# EAGLE design SM5100B_dev_board-v14 (EAGLE 5.04)

## Sheet 1 of 2
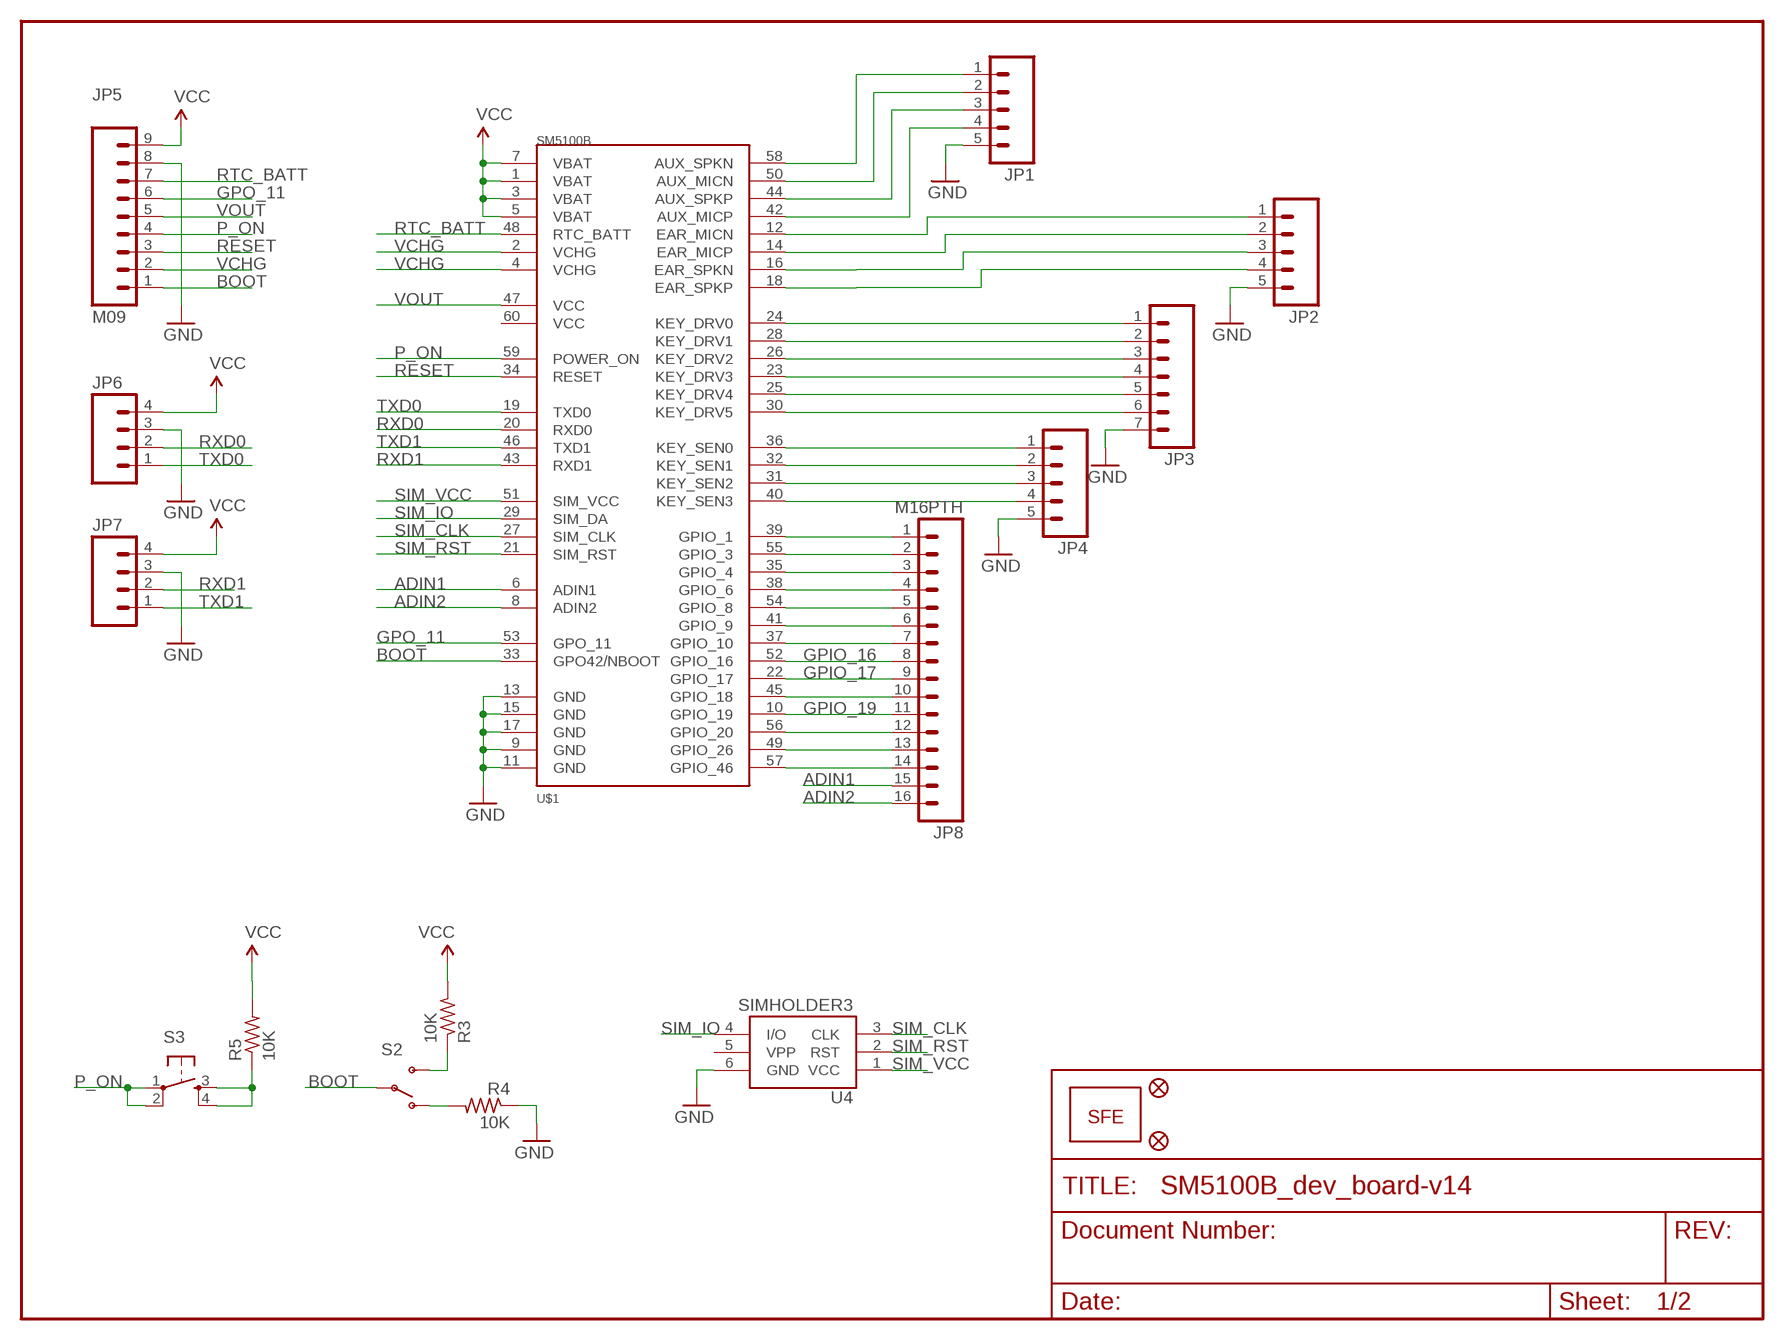
[diagram p0: schematic, sheet 1]

### Parts
JP1  M05PTH  [1X05]
JP2  M05PTH  [1X05]
JP3  M07  [1X07]
JP4  M05PTH  [1X05]
JP5  M09  [1X09]
JP6  M04PTH  [1X04]
JP7  M04PTH  [1X04]
JP8  M16PTH  [1X16]
JP9  LOGO-SFENEW  [SFE-NEW-WEBLOGO]
JP10  FIDUCIAL1X2  [FIDUCIAL-1X2]
JP11  FIDUCIAL1X2  [FIDUCIAL-1X2]
R3  10K  R-US_R0603  [R0603]
R4  10K  R-US_R0603  [R0603]
R5  10K  R-US_R0603  [R0603]
S2  SWITCH-SPSTSMD  [AYZ0202]
S3  TAC_SWITCHSMD  [TACTILE_SWITCH_SMD]
U4  SIMHOLDER3  [SIMHOLDER3]
U$1  SM5100B  [SM5100B]

### Nets
ADIN1: JP8.15 U$1.6(ADIN1)
ADIN2: JP8.16 U$1.8(ADIN2)
BOOT: JP5.1 S2.2(P) U$1.33(GPO42/NBOOT)
GND: JP1.5 JP2.5 JP3.7 JP4.5 JP5.8 JP6.3 JP7.3 R4.1 U4.6(GND) U$1.9(GND) U$1.11(GND) U$1.13(GND) U$1.15(GND) U$1.17(GND) ; also sheet 2
GPIO_16: JP8.8 U$1.52(GPIO_16) ; also sheet 2
GPIO_17: JP8.9 U$1.22(GPIO_17) ; also sheet 2
GPIO_19: JP8.11 U$1.10(GPIO_19) ; also sheet 2
GPO_11: JP5.6 U$1.53(GPO_11)
N$15: R3.1 S2.3(S)
N$16: R4.2 S2.1(O)
N$20: R5.1 S3.3 S3.4
N$31: JP1.1 U$1.58(AUX_SPKN)
N$32: JP1.2 U$1.50(AUX_MICN)
N$33: JP1.3 U$1.44(AUX_SPKP)
N$34: JP1.4 U$1.42(AUX_MICP)
N$35: JP2.1 U$1.12(EAR_MICN)
N$36: JP2.2 U$1.14(EAR_MICP)
N$37: JP2.3 U$1.16(EAR_SPKN)
N$38: JP2.4 U$1.18(EAR_SPKP)
N$39: JP3.1 U$1.24(KEY_DRV0)
N$40: JP3.2 U$1.28(KEY_DRV1)
N$41: JP3.3 U$1.26(KEY_DRV2)
N$42: JP3.4 U$1.23(KEY_DRV3)
N$43: JP3.5 U$1.25(KEY_DRV4)
N$44: JP3.6 U$1.30(KEY_DRV5)
N$45: JP4.1 U$1.36(KEY_SEN0)
N$46: JP4.2 U$1.32(KEY_SEN1)
N$47: JP4.3 U$1.31(KEY_SEN2)
N$48: JP4.4 U$1.40(KEY_SEN3)
N$49: JP8.1 U$1.39(GPIO_1)
N$50: JP8.2 U$1.55(GPIO_3)
N$51: JP8.3 U$1.35(GPIO_4)
N$52: JP8.4 U$1.38(GPIO_6)
N$53: JP8.5 U$1.54(GPIO_8)
N$54: JP8.6 U$1.41(GPIO_9)
N$55: JP8.7 U$1.37(GPIO_10)
N$58: JP8.10 U$1.45(GPIO_18)
N$60: JP8.12 U$1.56(GPIO_20)
N$61: JP8.13 U$1.49(GPIO_26)
N$62: JP8.14 U$1.57(GPIO_46)
P_ON: JP5.4 S3.1 S3.2 U$1.59(POWER_ON)
RESET: JP5.3 U$1.34(RESET)
RTC_BATT: JP5.7 U$1.48(RTC_BATT)
RXD0: JP6.2 U$1.20(RXD0) ; also sheet 2
RXD1: JP7.2 U$1.43(RXD1)
SIM_CLK: U4.3(CLK) U$1.27(SIM_CLK)
SIM_IO: U4.4(I/O) U$1.29(SIM_DA)
SIM_RST: U4.2(RST) U$1.21(SIM_RST)
SIM_VCC: U4.1(VCC) U$1.51(SIM_VCC)
TXD0: JP6.1 U$1.19(TXD0) ; also sheet 2
TXD1: JP7.1 U$1.46(TXD1)
VCC: JP5.9 JP6.4 JP7.4 R3.2 R5.2 U$1.1(VBAT) U$1.3(VBAT) U$1.5(VBAT) U$1.7(VBAT) ; also sheet 2
VCHG: JP5.2 U$1.2(VCHG) U$1.4(VCHG)
VOUT: JP5.5 U$1.47(VCC)
Unconnected: U4.5(VPP) U$1.60(VCC)

## Sheet 2 of 2
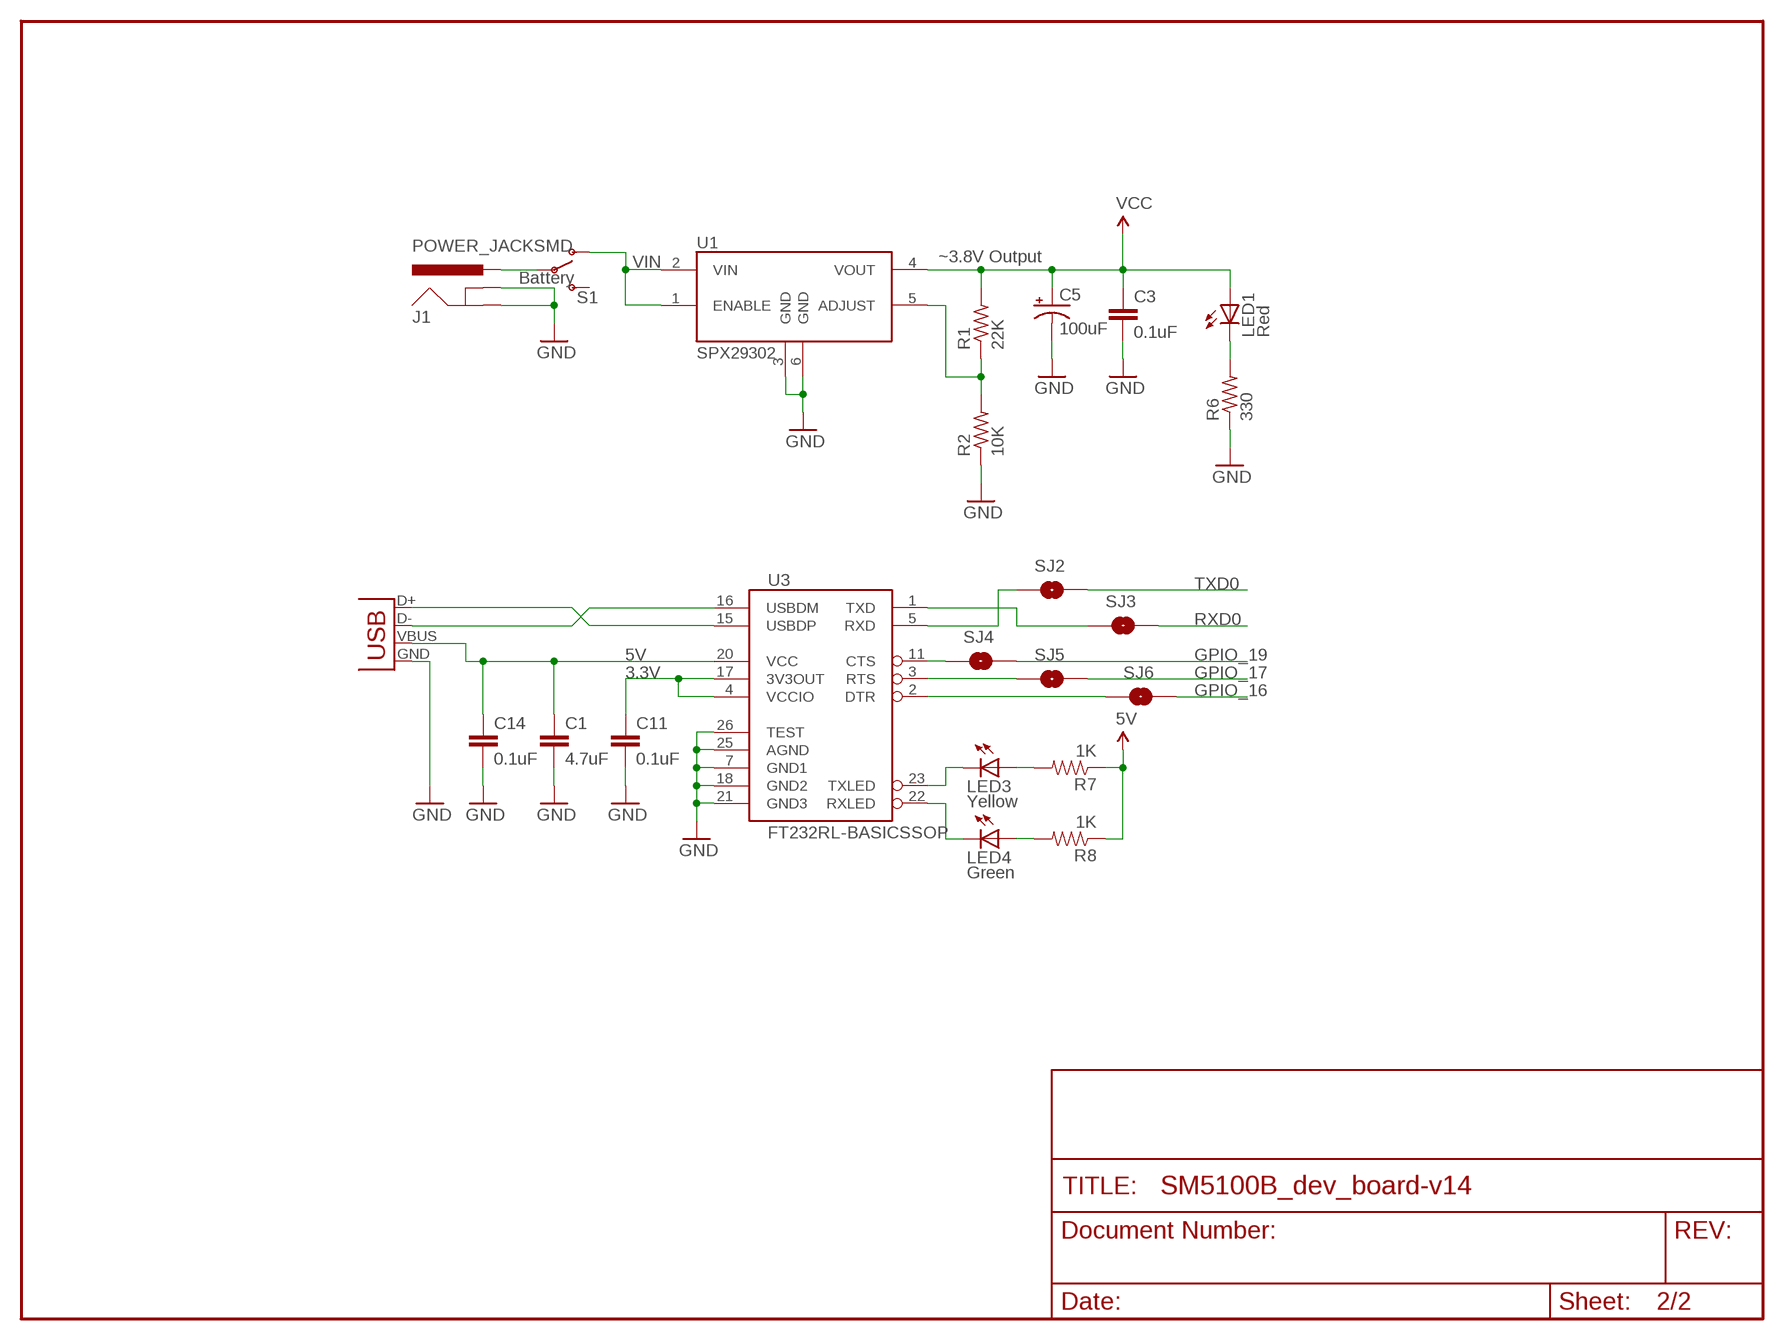
[diagram p1: schematic, sheet 2]

### Parts
C1  4.7uF  CAP0402-CAP  [0402-CAP]
C3  0.1uF  CAP0603-CAP  [0603-CAP]
C5  100uF  CAP_POL7343  [EIA7343]
C11  0.1uF  CAP0402-CAP  [0402-CAP]
C14  0.1uF  CAP0402-CAP  [0402-CAP]
J1  POWER_JACKSMD  [POWER_JACK_SMD]
LED1  Red  LED0603  [LED-0603]
LED3  Yellow  LED0603  [LED-0603]
LED4  Green  LED0603  [LED-0603]
R1  22K  R-US_R0603  [R0603]
R2  10K  R-US_R0603  [R0603]
R6  330  R-US_R0603  [R0603]
R7  1K  RESISTOR0402-RES  [0402-RES]
R8  1K  RESISTOR0402-RES  [0402-RES]
S1  Battery  SWITCH-SPSTSMD  [AYZ0202]
SJ2  SOLDERJUMPERNC2  [SJ_2S-NOTRACE]
SJ3  SOLDERJUMPERNC2  [SJ_2S-NOTRACE]
SJ4  SOLDERJUMPERNC2  [SJ_2S-NOTRACE]
SJ5  SOLDERJUMPERNC2  [SJ_2S-NOTRACE]
SJ6  SOLDERJUMPERNC2  [SJ_2S-NOTRACE]
U1  SPX29302  [Q5-DD_SPX29300]
U3  FT232RL-BASICSSOP  [SSOP28DB]
X1  USBSMD  [USB-MINIB]

### Nets
3.3V [vcc]: C11.1 U3.4(VCCIO) U3.17(3V3OUT)
5V [vcc]: C1.1 C14.1 R7.1 R8.1 U3.20(VCC) X1.VBUS
ADJUST: R1.1 R2.2 U1.5(ADJUST)
GND: C1.2 C3.2 C5.C(-) C11.2 C14.2 J1.GND(GNDBREAK) J1.P$4(GND) R2.1 R6.1 U1.3(GND) U1.6(GND) U3.7(GND1) U3.18(GND2) U3.21(GND3) U3.25(AGND) U3.26(TEST) X1.GND ; also sheet 1
GPIO_16: SJ6.2 ; also sheet 1
GPIO_17: SJ5.2 ; also sheet 1
GPIO_19: SJ4.2 ; also sheet 1
N$1: U3.15(USBDP) X1.D+
N$2: SJ2.1 U3.5(RXD)
N$3: U3.16(USBDM) X1.D-
N$4: SJ3.1 U3.1(TXD)
N$6: SJ4.1 U3.11(CTS)
N$7: LED3.A R7.2
N$12: SJ5.1 U3.3(RTS)
N$13: SJ6.1 U3.2(DTR)
N$14: J1.VIN0(PWR) S1.2(P)
N$17: LED1.C R6.2
N$18: LED4.A R8.2
RXD0: SJ3.2 ; also sheet 1
RXLED: LED4.C U3.22(RXLED)
TXD0: SJ2.2 ; also sheet 1
TXLED: LED3.C U3.23(TXLED)
VCC: C3.1 C5.A(+) LED1.A R1.2 U1.4(VOUT) ; also sheet 1
VIN: S1.1(O) U1.1(ENABLE) U1.2(VIN)
Unconnected: S1.3(S)

### Notes on the sheet
- ~3.8V Output

## Library data of the parts
C1 C3 C11 C14 = SparkFun:CAP: Capacitor Standard 0603 ceramic capacitor, and 0.1" leaded capacitor.
C5 = SparkFun:CAP_POL: Capacitor Polarized These are standard SMD and PTH capacitors. Normally 10uF, 47uF, and 100uF in electrolytic and tantalum varieties. Always verify the external diameter of the through hole cap, it varies with capacity, voltage, and manufacturer. The EIA devices should be standard.
J1 = SparkFun:POWER_JACK: Power Jack This is the standard 5.5mm barrel jack for power. The PTH is the most common, proven, reliable, footprint. All others are experimental. The Slot footprint only works if the mill layer is transmitted to the PCB fab house so be warned. Spark Fun Electronics SKU : PRT-00119. Mating wall wart : TOL-00298 (and others)
JP1 JP2 JP4 = SparkFun:M05: Header 5 Standard 5-pin 0.1" header. Use with straight break away headers (SKU : PRT-00116), right angle break away headers (PRT-00553), swiss pins (PRT-00743), machine pins (PRT-00117), and female headers (PRT-00115). Molex polarized connector foot print use with SKU : PRT-08230 with associated crimp pins and housings.
JP3 = SparkFun:M07: Header 7 Standard 7-pin 0.1" header. Use with straight break away headers (SKU : PRT-00116), right angle break away headers (PRT-00553), swiss pins (PRT-00743), machine pins (PRT-00117), and female headers (PRT-00115). NOTES ON THE VARIANTS LOCK and LOCK_LONGPADS... This footprint was designed to help hold the alignment of a through-hole component (i.e. 7-pin header) while soldering it into place. You may notice that each hole has been shifted either up or down by 0.005 of an inch from it's more standard position (which is usually a perfectly straight line). This slight alteration caused the pins (the squares in the middle) to touch the edges of the holes. Because they are alternating, it causes a "brace" to hold the header in place. 0.005 has proven to be the perfect amount of "off-center" position when using our standard breakaway headers. Although looks a little odd when you look at the bare footprint, once you have a header in there, the alteration is very hard to notice. Also, if you push a header all the way into place, it is covered up entirely on the bottom side. This idea of altering the position of holes to aid alignment will be further integrated into the Sparkfun Library for other footprints. It can help hold any component with 3 or more connection pins.
JP5 = SparkFun:M09: Header 9 Standard 9-pin 0.1" header. Use with straight break away headers (SKU : PRT-00116), right angle break away headers (PRT-00553), swiss pins (PRT-00743), machine pins (PRT-00117), and female headers (PRT-00115).
JP6 JP7 = SparkFun:M04: Header 4 Standard 4-pin 0.1" header. Use with straight break away headers (SKU : PRT-00116), right angle break away headers (PRT-00553), swiss pins (PRT-00743), machine pins (PRT-00117), and female headers (PRT-00115). Molex polarized connector foot print use with SKU : PRT-08231 with associated crimp pins and housings.
JP8 = SparkFun:M16
JP9 = SparkFun:LOGO-SFE: Spark Fun Electronics PCB Logo This is the standard Spark Fun Electronics PCB logo.
JP10 JP11 = SparkFun:FIDUCIAL: Fiducial Alignment Points Various fiducial points for machine vision alignment.
LED1 LED3 LED4 = SparkFun:LED: LEDs Standard schematic elements and footprints for 5mm, 3mm, 1206, and 0603 sized LEDs. 5mm - Spark Fun Electronics SKU : COM-00529 (and others)
R1-R6 = rcl:R-US_: RESISTOR, American symbol
R7 R8 = SparkFun:RESISTOR: Resistor Basic schematic elements and footprints for 0603, 1206, and PTH 1/10th watt (small) resistors.
S1 S2 = SparkFun:SWITCH-SPST: SPST Switch Simple slide switch. Spark Fun Electronics SKU : COM-00102
S3 = SparkFun:TAC_SWITCH: Momentary Switch Button commonly used for reset or general input. Spark Fun Electronics SKU : COM-00097
SJ2-SJ6 = SparkFun:SOLDERJUMPER: Solder Jumper Standard SMD solder jumper. Used to automate production. Two varients : Normally Open and Normally Closed are the same, but have different paste layers. NC will have a large amount of paste and should jumper during reflow.
U1 = SparkFun:SPX29302
U3 = SparkFun:FT232RL-BASIC: USB UART This is the simplified version of the FT232RL unit. Only what you need, nothing you don't. Spark Fun Electronics SKU : COM-00650
U4 = SparkFun:SIMHOLDER3
U$1 = SparkFun:SM5100B
X1 = SparkFun:USB: USB Connectors USB-B-PTH is fully proven SKU : PRT-00139 USB-miniB is fully proven SKU : PRT-00587 USB-A-PCB is untested. USB-A-H is throughly reviewed, but untested. Spark Fun Electronics SKU : PRT-00437 USB-B-SMT is throughly reviewed, but untested. Needs silkscreen touching up. USB-A-S has not been used/tested USB-MB-H has not been used/tested

## Net classes
0 default: width 0.203 mm
1 vcc: width 0.254 mm

## Board
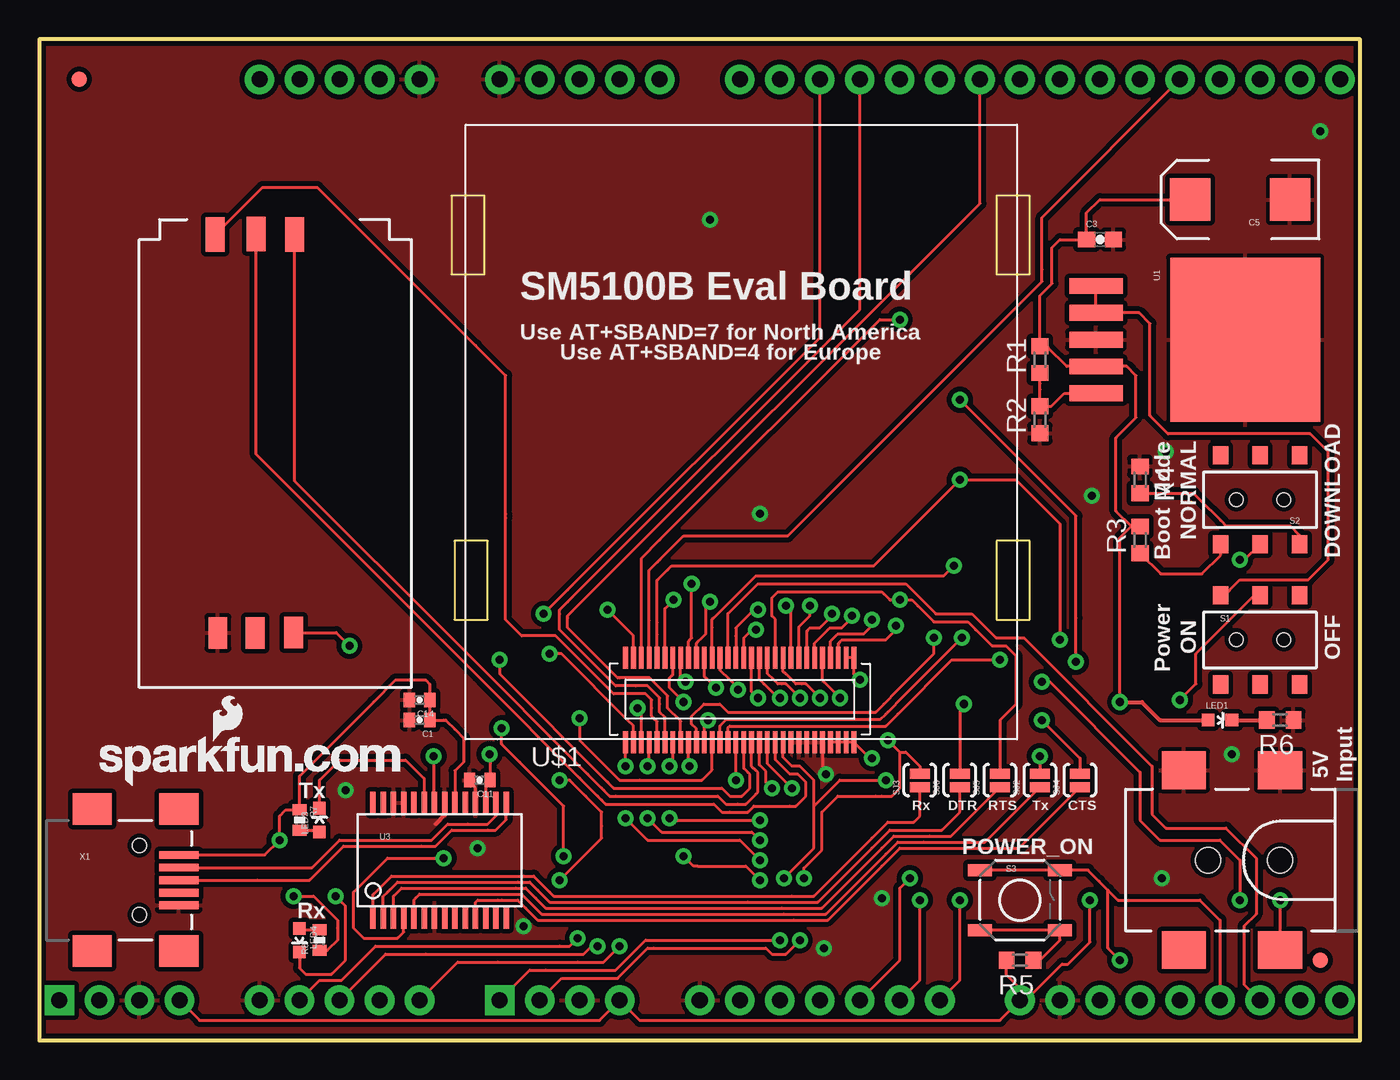
[diagram p2: board, top side]
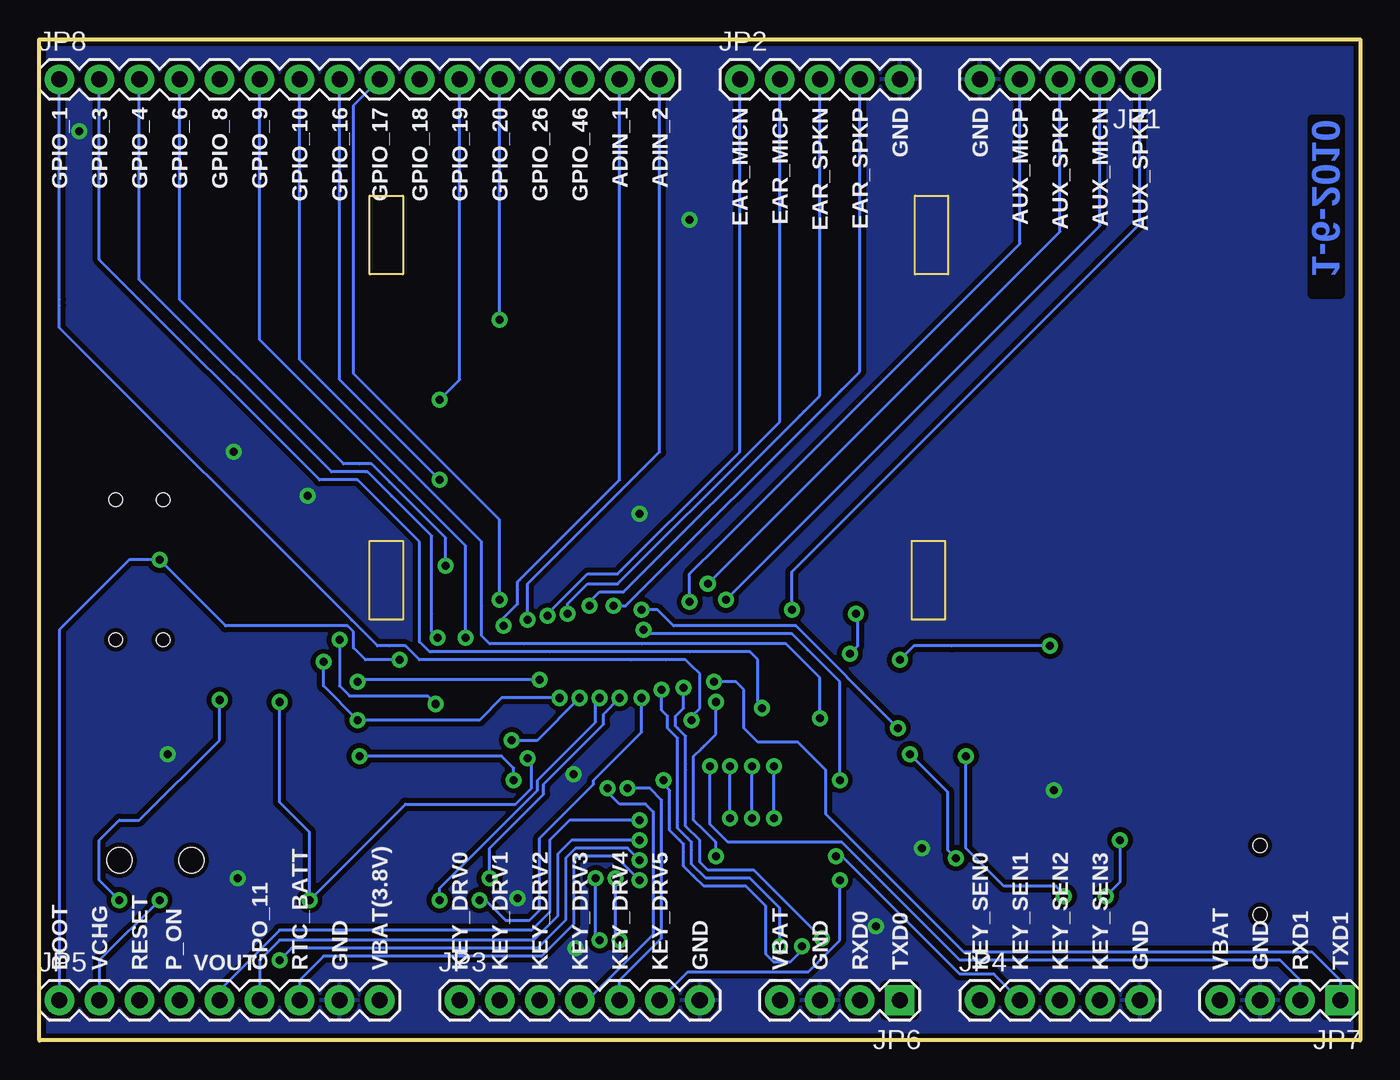
[diagram p3: board, bottom side, seen from below]

Size 83.82 x 63.5 mm. Coordinates in mm from the lower left corner, seen from the top.
Outline: 83.82,0 83.82,63.5 0,63.5 0,0 83.82,0
Copper layers (1*16): Top 0.035mm / dielectric 1.5mm / Bottom 0.035mm
Design rules "SparkFun *": minimum track width 7mil, minimum drill 20mil, track to track 6mil, track to pad 8mil, pad to pad 6mil, via to via 8mil, smd to smd 6mil, copper to edge 8mil, drill to drill 8mil, minimum pad ring 12mil, minimum via ring 10mil, stop-mask expansion 4mil, vias tented up to drill 25mil, thermal gap 10mil

### Footprints (pad centres in the part's own frame; a part is rotated, then mirrored left to right if it is on the bottom)
0402-CAP = smd 0.7 x 0.9: 1 -0.65,0; 2 0.65,0
0603-CAP = smd 1.1 x 1: 1 -0.85,0; 2 0.85,0
EIA7343 = smd 2.55 x 2.7: A 3.17,0; C -3.17,0
POWER_JACK_SMD = smd 2.8 x 2.4: GND 0,-5.7; P$4 6.1,-5.7; VIN0 0,5.7; VIN1 6.1,5.7 | hole 1.6: 0,0; 4.572,0
1X05 = drill 1.016 pad 1.88 round: 1 0,0; 2 2.54,0; 3 5.08,0; 4 7.62,0; 5 10.16,0
1X07 = drill 1.016 pad 1.88 round: 1 0,0; 2 2.54,0; 3 5.08,0; 4 7.62,0; 5 10.16,0; 6 12.7,0; 7 15.24,0
1X09 = drill 1.016 pad 1.88 round: 1 0,0; 2 2.54,0; 3 5.08,0; 4 7.62,0; 5 10.16,0; 6 12.7,0; 7 15.24,0; 8 17.78,0; 9 20.32,0
1X04 = drill 1.016 pad 1.88 square: 1 0,0 | drill 1.016 pad 1.88 round: 2 2.54,0; 3 5.08,0; 4 7.62,0
1X16 = drill 1.016 pad 1.88 round: 1 0,0; 2 2.54,0; 3 5.08,0; 4 7.62,0; 5 10.16,0; 6 12.7,0; 7 15.24,0; 8 17.78,0; 9 20.32,0; 10 22.86,0; 11 25.4,0; 12 27.94,0; 13 30.48,0; 14 33.02,0; 15 35.56,0; 16 38.1,0
FIDUCIAL-1X2 = smd 1 x 1: 1 0,0
LED-0603 = smd 0.8 x 0.8: A 0,-0.75; C 0,0.75
R0603 = smd 1 x 1.1: 1 -0.85,0; 2 0.85,0
0402-RES = smd 0.7 x 0.9: 1 -0.65,0; 2 0.65,0
AYZ0202 = smd 1 x 1.15: 1 -2.5,2.825; 2 0,2.825; 3 2.5,2.825; 4 -2.5,-2.825; 5 0,-2.825; 6 2.5,-2.825 | hole 0.85: 1.5,0; -1.5,0
TACTILE_SWITCH_SMD = smd 1.524 x 0.762: 1 -2.54,1.905; 2 2.54,1.905; 3 -2.54,-1.905; 4 2.54,-1.905
SJ_2S-NOTRACE = smd 0.635 x 1.27: 1 -0.45,0; 2 0.4,0
Q5-DD_SPX29300 = smd 1 x 3.4: 1 -3.4,-7.875; 2 -1.7,-7.875; 3 0,-7.875; 4 1.7,-7.875; 5 3.4,-7.875 | smd 10.414 x 9.525: 6 0,1.595
SSOP28DB = smd 0.348 x 1.397: 1 -4.225,-3.656; 2 -3.575,-3.656; 3 -2.925,-3.656; 4 -2.275,-3.656; 5 -1.625,-3.656; 6 -0.975,-3.656; 7 -0.325,-3.656; 8 0.325,-3.656; 9 0.975,-3.656; 10 1.625,-3.656; 11 2.275,-3.656; 12 2.925,-3.656; 13 3.575,-3.656; 14 4.225,-3.656; 15 4.225,3.656; 16 3.575,3.656; 17 2.925,3.656; 18 2.275,3.656; 19 1.625,3.656; 20 0.975,3.656; 21 0.325,3.656; 22 -0.325,3.656; 23 -0.975,3.656; 24 -1.625,3.656; 25 -2.275,3.656; 26 -2.925,3.656; 27 -3.575,3.656; 28 -4.225,3.656
SIMHOLDER3 = smd 2.2 x 1.2: 1 0.95,4.81; 2 0.91,7.41; 3 0.95,9.86 | smd 2 x 1.2: 4 26.2,9.78; 5 26.22,7.34; 6 26.22,4.98
SM5100B = smd 0.3 x 1.4: 1 7.25,-2.68; 2 7.25,2.68; 3 6.75,-2.68; 4 6.75,2.68; 5 6.25,-2.68; 6 6.25,2.68; 7 5.75,-2.68; 8 5.75,2.68; 9 5.25,-2.68; 10 5.25,2.68; 11 4.75,-2.68; 12 4.75,2.68; 13 4.25,-2.68; 14 4.25,2.68; 15 3.75,-2.68; 16 3.75,2.68; 17 3.25,-2.68; 18 3.25,2.68; 19 2.75,-2.68; 20 2.75,2.68; 21 2.25,-2.68; 22 2.25,2.68; 23 1.75,-2.68; 24 1.75,2.68; 25 1.25,-2.68; 26 1.25,2.68; 27 0.75,-2.68; 28 0.75,2.68; 29 0.25,-2.68; 30 0.25,2.68; 31 -0.25,-2.68; 32 -0.25,2.68; 33 -0.75,-2.68; 34 -0.75,2.68; 35 -1.25,-2.68; 36 -1.25,2.68; 37 -1.75,-2.68; 38 -1.75,2.68; 39 -2.25,-2.68; 40 -2.25,2.68; 41 -2.75,-2.68; 42 -2.75,2.68; 43 -3.25,-2.68; 44 -3.25,2.68; 45 -3.75,-2.68; 46 -3.75,2.68; 47 -4.25,-2.68; 48 -4.25,2.68; 49 -4.75,-2.68; 50 -4.75,2.68; 51 -5.25,-2.68; 52 -5.25,2.68; 53 -5.75,-2.68; 54 -5.75,2.68; 55 -6.25,-2.68; 56 -6.25,2.68; 57 -6.75,-2.68; 58 -6.75,2.68; 59 -7.25,-2.68; 60 -7.25,2.68
USB-MINIB = smd 2.5 x 0.5: D+ 2.5,0; D- 2.5,0.8; GND 2.5,-1.6; ID 2.5,-0.8; VBUS 2.5,1.6 | smd 2.5 x 2: GND@1 -3,-4.5; GND@2 -3,4.5; GND@3 2.5,4.5; GND@4 2.5,-4.5 | hole 0.9: 0,2.2; 0,-2.2

### Placement (x,y rotation side)
C1  24.13,20.32 180 top
C3  67.31,50.8 0 top
C5  76.2,53.34 180 top
C11  27.94,16.51 180 top
C14  24.13,21.59 180 top
J1  78.74,11.43 180 top
JP1  13.97,60.96 180 bottom
JP2  39.37,60.96 0 bottom
JP3  57.15,2.54 0 bottom
JP4  24.13,2.54 0 bottom
JP5  82.55,2.54 0 bottom
JP6  29.21,2.54 180 bottom
JP7  1.27,2.54 180 bottom
JP8  82.55,60.96 0 bottom
JP9  3.81,16.13 0 top
JP10  2.54,60.96 0 top
JP11  81.28,5.08 0 top
LED1  74.93,20.32 270 top
LED3  17.78,13.97 0 top
LED4  16.51,6.35 180 top
R1  63.5,43.18 90 top
R2  63.5,39.37 90 top
R3  69.85,31.75 90 top
R4  69.85,35.56 270 top
R5  62.23,5.08 180 top
R6  78.74,20.32 180 top
R7  16.51,13.97 270 top
R8  17.78,6.35 90 top
S1  77.47,25.4 0 top
S2  77.47,34.29 180 top
S3  62.23,8.89 0 top
SJ2  63.5,16.51 90 top
SJ3  55.88,16.51 90 top
SJ4  66.04,16.51 90 top
SJ5  60.96,16.51 90 top
SJ6  58.42,16.51 90 top
U1  74.93,44.45 270 top
U3  25.4,11.43 0 top
U4  6.35,52.07 270 top
U$1  44.45,21.59 0 top
X1  6.35,10.16 0 top

### Tracks (layer width: path | path; a pad name or v marks a point on that pad's centre or on a via)
3.3V  (via drill 0.51)
  Top 0.203: U3.4 23.12,6.87 23.11,6.86 23.1,6.85 22.73,6.48 20.57,6.48 19.94,7.11 19.94,9.4 22.1,11.56 v25.65,11.56 | U3.17 28.33,16.26 28.58,16.51 C11.1 28.59,18.15 v28.58,18.16
  Bottom 0.203: v28.58,18.16 26.16,15.75 26.16,12.95 26.16,12.19 26.16,12.06 v25.65,11.56
5V  (via drill 0.51)
  Top 0.203: R8.1 18.27,5.7 18.92,6.35 18.92,7.11 18.92,7.62 18.03,8.51 17.4,9.14 v16.13,9.14 | X1.VBUS 14.3,11.76 v15.24,12.7 15.24,12.83 15.24,14.22 15.64,14.62 R7.1 16.51,16.76 21.21,21.46 22.61,22.86 23.49,22.86 23.75,22.86 24.51,22.86 24.78,22.59 C14.1 24.78,20.59 24.77,20.57 24.78,20.56 C1.1 25.65,20.32 25.78,20.32 26.38,19.73 26.92,19.18 26.92,18.54 26.92,17.65 26.42,17.14 26.38,17.1 U3.20
  Bottom 0.203: v16.13,9.14 15.24,10.03 v15.24,12.7
ADIN1  (via drill 0.51)
  Top 0.203: 50.7,25.17 50.8,25.27 | 50.8,25.27 50.93,25.4 51.18,25.4 53.72,25.4 54.36,26.04 v54.36,26.29 | U$1.6 50.7,25.17 | 50.7,25.17 50.8,25.27
  Bottom 0.178: 53.47,29.08 53.34,29.21
  Bottom 0.203: JP8.15 46.99,35.56 53.34,29.21 | 53.47,29.08 53.47,28.57 53.47,27.69 54.36,26.8 v54.36,26.29
ADIN2  (via drill 0.51)
  Top 0.178: v52.83,26.67 52.83,26.42
  Top 0.203: v52.83,26.67 52.83,26.29 52.32,25.78 52.2,25.78 50.8,25.78 50.67,25.78 50.29,25.4 | 50.2,25.31 50.29,25.4 | U$1.8 50.2,25.31 | 50.2,25.31 50.29,25.4
  Bottom 0.178: v52.83,26.67 52.83,26.8
  Bottom 0.203: JP8.16 44.45,37.34 52.83,28.96 52.83,26.8
ADJUST
  Top 0.203: 63.41,42.42 R1.1 63.5,41.66 63.5,41.28 R2.2 64.22,40.22 64.26,40.26 65.05,41.05 U1.5
BOOT  (via drill 0.51)
  Top 0.203: 43.71,19.84 43.81,19.94 53.72,19.94 54.48,20.7 57.91,24.13 v60.96,24.13 | 43.7,19.82 43.71,19.84 | S2.2 76.48,30.48 v76.2,30.48 | 43.7,19.82 43.71,19.84 | U$1.33 43.7,19.82 | 43.7,19.82 43.71,19.84
  Bottom 0.203: JP5.1 82.55,26.04 78.11,30.48 v76.2,30.48 76.07,30.35 72.01,26.29 64.26,26.29 63.88,25.91 63.88,24.89 63.12,24.13 v60.96,24.13
GND  (via drill 0.51)
  Top 0.203: C11.2 27.29,16.4 27.67,16.01 U3.18 | U$1.9 49.7,17.1 v49.91,16.89
  Top 0.254: U3.21 25.73,14.29 25.15,13.72
  other vias: 27.81,12.19 49.78,5.84 45.72,33.4 42.55,52.07 53.47,9.02 19.43,15.88 30.73,7.24 66.8,34.54 71.5,37.34 81.28,57.66 71.25,10.29 75.69,18.16
  pour Top (isolate 0.305): 83.82,0 83.82,63.5 0,63.5 0,0
  pour Bottom (isolate 0.305): 83.82,0 83.82,63.5 0,63.5 0,0
GPIO_16  (via drill 0.51)
  Top 0.203: U$1.52 39.19,24.28 39.2,24.29 39.2,25.74 39.2,26.5 39.2,29.17 39.24,29.21 39.88,29.84 40.13,30.1 41.4,30.1 48.39,30.1 52.96,30.1 v58.42,35.56 61.98,35.56 64.77,32.77 v64.77,25.4 | SJ6.2 58.42,21.08 v58.67,21.34
  Bottom 0.203: JP8.8 64.77,41.91 v58.42,35.56 | v64.77,25.4 64.77,22.48 64.14,21.84 59.18,21.84 v58.67,21.34
GPIO_17  (via drill 0.51)
  Top 0.203: 61.09,20.45 61.98,21.34 61.98,24.38 61.34,25.02 61.21,25.02 60.45,25.02 59.44,26.04 58.93,26.54 57.28,26.54 56.77,26.54 55.75,27.56 55.37,27.94 v54.61,27.94 53.98,27.94 53.59,28.32 53.47,28.45 50.29,28.45 46.99,28.45 46.86,28.45 46.48,28.07 46.48,27.05 46.48,26.92 46.7,26.71 46.7,25.44 46.7,24.29 46.74,24.26 46.72,24.27 U$1.22 | 61.09,20.45 60.96,20.32 | 60.96,20.32 SJ5.2 | 61.09,20.45 60.96,20.32
  Bottom 0.203: v54.61,27.94 54.61,33.02 54.99,33.4 62.23,40.64 63.88,42.29 63.88,42.42 63.88,59.31 JP8.9
GPIO_19  (via drill 0.51)
  Top 0.203: 49.78,22.73 49.7,22.82 | 49.78,22.73 v50.8,21.72 | v58.42,40.64 65.79,33.27 65.79,26.8 v65.79,24 | 49.7,22.82 U$1.10 | 49.78,22.73 49.7,22.82 | SJ4.2 66.04,17.91 v63.63,20.32
  Bottom 0.203: v50.8,21.72 54.48,21.72 55.88,20.32 61.98,20.32 v63.63,20.32 65.79,22.48 v65.79,24 | JP8.11 57.15,41.91 v58.42,40.64
GPO_11  (via drill 0.51)
  Top 0.203: 38.7,17.49 v38.61,17.4 38.71,17.5 38.7,17.51 U$1.53 | v38.61,14.1 39.5,13.21 45.21,13.21 v45.72,12.7
  Bottom 0.203: v38.61,14.1 v38.61,17.4 | v45.72,12.7 50.04,12.7 50.93,11.81 50.93,7.87 52.45,6.35 68.58,6.35 69.85,5.08 JP5.6
N$1
  Top 0.203: U3.15 29.62,14 29.08,13.46 28.96,13.33 28.45,13.33 26.16,13.33 25.65,12.83 25.15,12.32 24.26,12.32 19.3,12.32 17.14,10.16 13.84,10.16 X1.D+
N$2
  Top 0.203: SJ2.1 60.01,12.57 56.13,12.57 54.48,12.57 53.72,11.81 49.91,8 47.24,8 31.88,8 30.61,9.27 24.13,9.27 23.88,9.02 23.77,8.92 U3.5
N$3
  Top 0.203: X1.D- 17.31,10.96 19.05,12.7 24.89,12.7 25.91,13.72 27.18,13.72 28.45,13.72 28.98,14.24 U3.16
N$4
  Top 0.203: SJ3.1 55.88,14.22 55.5,13.84 53.85,13.84 52.83,12.83 49.15,9.14 47.75,9.14 32.64,9.14 32.38,9.4 31.37,10.41 30.73,10.41 22.35,10.41 21.21,9.27 21.17,9.24 U3.1
N$6
  Top 0.203: SJ4.1 62.17,12.19 59.56,12.19 54.61,12.19 53.47,11.05 50.04,7.62 47.88,7.62 31.62,7.62 30.86,8.38 30.35,8.89 29.34,8.89 29.08,8.89 27.81,8.89 27.67,8.75 U3.11
N$7
  Top 0.203: LED3.A 17.66,13.22 17.65,13.21 17.54,13.32 R7.2
N$12
  Top 0.203: SJ5.1 57.85,12.95 56.52,12.95 54.23,12.95 53.47,12.19 49.66,8.38 47.12,8.38 32.13,8.38 31.5,9.02 30.86,9.65 30.23,9.65 22.99,9.65 22.48,9.14 U3.3
N$13
  Top 0.203: SJ6.1 58.42,14.48 57.28,13.33 53.98,13.33 52.83,12.19 49.4,8.76 44.96,8.76 32.38,8.76 31.62,9.53 31.12,10.03 30.35,10.03 22.73,10.03 22.23,9.53 22.1,9.4 21.83,9.12 U3.2
N$14  (via drill 0.51)
  Top 0.203: v72.39,21.59 73.41,22.61 73.41,24.51 77.12,28.22 S1.2 | J1.VIN0 v78.74,8.89
  Bottom 0.203: v72.39,21.59 72.39,19.05 77.47,13.97 78.74,13.97 80.01,12.7 80.01,10.16 v78.74,8.89
N$15
  Top 0.203: R3.1 71.16,29.59 72.9,29.59 73.28,29.59 73.79,29.59 74.97,30.77 S2.3
N$16
  Top 0.203: R4.2 73.24,34.71 73.66,34.29 74.97,32.98 75.31,32.64 77.22,32.64 77.47,32.64 79.38,32.64 79.97,32.04 S2.1
N$17
  Top 0.254: LED1.C R6.2
N$18
  Top 0.203: LED4.A 16.51,7.24 16.75,7 R8.2
N$20
  Top 0.203: S3.3 63.12,6.98 63.63,6.98 S3.4 64.77,6.35 63.5,5.08 R5.1
N$31  (via drill 0.51)
  Top 0.203: 37.7,25.67 37.59,25.78 | 37.59,25.78 v36.07,27.3 | U$1.58 37.7,25.67 | 37.7,25.67 37.59,25.78
  Bottom 0.203: v36.07,27.3 36.07,29.72 35.31,30.48 16.51,49.28 16.38,49.4 13.97,51.82 JP1.1
N$32  (via drill 0.51)
  Top 0.203: v40.26,27.94 39.7,27.38 39.7,27.25 39.7,24.28 | 39.7,24.28 | U$1.50 39.7,24.28
  Bottom 0.203: v40.26,27.94 19.05,49.15 18.92,49.28 16.51,51.69 JP1.2
N$33  (via drill 0.51)
  Top 0.203: 41.27,25.4 41.4,25.53 41.4,28.7 v41.4,28.96 | 41.2,25.32 41.27,25.4 | U$1.44 41.2,25.32 | 41.2,25.32 41.27,25.4
  Bottom 0.203: v41.4,28.96 21.59,48.77 21.46,48.9 19.05,51.31 JP1.3
N$34  (via drill 0.51)
  Top 0.203: 41.78,25.27 42.04,25.53 42.29,25.78 42.29,27.43 42.55,27.69 v42.55,27.81 | 41.7,25.19 41.78,25.27 | U$1.42 41.7,25.19 | 41.7,25.19 41.78,25.27
  Bottom 0.203: v42.55,27.81 42.55,29.59 40.64,31.5 24.13,48.01 24,48.13 21.59,50.55 JP1.4
N$35  (via drill 0.51)
  Top 0.178: 51.43,26.67 51.31,26.54 51.18,26.42 | 49.53,25.53 49.66,25.65 | 49.2,25.2 49.28,25.27 | 51.56,26.8 v51.56,26.92
  Top 0.203: 49.53,25.53 49.28,25.27 49.2,25.2 U$1.12 | 49.66,25.65 50.16,26.16 50.42,26.16 50.93,26.16 51.18,26.42 | 51.43,26.67 51.56,26.8
  Bottom 0.203: v51.56,26.92 51.56,27.05 49.02,29.59 47.88,29.59 47.12,29.59 46.86,29.84 40.64,36.07 40.51,36.2 39.37,37.34 JP2.1
N$36  (via drill 0.51)
  Top 0.203: 48.77,26.04 48.89,26.16 49.53,26.16 49.91,26.54 50.29,26.92 v50.29,27.05 | 48.7,25.97 48.77,26.04 | U$1.14 48.7,25.97 | 48.7,25.97 48.77,26.04
  Bottom 0.203: v50.29,27.05 50.29,27.18 50.29,27.69 49.02,28.96 47.12,28.96 38.1,37.97 37.97,38.1 36.83,39.24 JP2.2
N$37  (via drill 0.51)
  Top 0.203: 48.2,26.23 48.26,26.29 | 48.26,26.29 48.89,26.92 v48.89,27.56 | U$1.16 48.2,26.23 | 48.2,26.23 48.26,26.29
  Bottom 0.203: 48.89,27.69 v48.89,27.56 48.89,27.81 48.26,28.45 47.62,28.45 47.5,28.45 46.74,28.45 35.56,39.62 35.31,39.88 34.29,40.89 JP2.3
N$38  (via drill 0.51)
  Top 0.203: 47.62,27.3 v47.37,27.56 47.62,27.3 | 47.7,27.23 47.62,27.3 | U$1.18 47.7,27.23 | 47.7,27.23 47.62,27.3
  Bottom 0.203: v47.37,27.56 47.24,27.56 46.61,27.56 33.02,41.15 32.89,41.28 31.75,42.42 JP2.4
N$39  (via drill 0.51)
  Top 0.203: v48.26,21.72 47.37,22.61 47.12,22.61 46.86,22.61 46.61,22.86 46.2,23.27 46.2,24.1 46.23,24.13 46.2,24.16 U$1.24 | JP3.1 58.42,3.81 v58.42,8.89
  Bottom 0.203: v48.26,21.72 48.26,21.59 48.51,21.34 48.51,20.83 48.51,20.19 51.94,16.76 52.2,16.51 52.2,16.13 52.2,15.88 52.58,15.49 58.42,9.65 58.42,9.02 v58.42,8.89
N$40  (via drill 0.51)
  Top 0.203: v45.59,21.72 45.2,22.11 45.2,24.12 45.21,24.13 45.2,24.14 U$1.28 | JP3.2 55.88,3.81 v55.88,8.89
  Bottom 0.203: v55.88,8.89 55.5,8.89 54.74,8.13 54.23,7.62 52.7,7.62 52.07,8.26 52.07,12.7 52.07,12.83 50.67,14.22 48.64,16.26 48.64,16.51 45.59,19.56 45.59,21.34 v45.59,21.72
N$41  (via drill 0.51)
  Top 0.203: v46.99,21.72 46.86,21.72 46.74,21.84 45.97,22.61 45.7,22.88 45.7,23.98 45.72,24 45.7,24.02 U$1.26 | v55.24,10.29 55.12,10.16 54.61,9.65 54.61,5.08 JP3.3
  Bottom 0.203: 55.24,10.41 v55.24,10.29 55.24,10.54 55.24,12.19 52.83,14.61 51.82,15.62 51.82,16.13 51.82,16.26 50.42,17.65 48.01,20.07 48.01,20.57 48.01,20.7 v46.99,21.72
N$42  (via drill 0.51)
  Top 0.203: 46.23,17.53 46.41,17.35 v47.75,16 | 46.23,17.53 46.2,17.55 | 46.2,17.55 U$1.23 | 46.23,17.53 46.2,17.55
  Bottom 0.203: v47.75,16 47.75,15.75 46.99,14.99 45.34,14.99 44.83,14.48 44.83,9.65 44.83,6.73 45.97,5.59 47.62,3.94 49.02,2.54 JP3.4
N$43  (via drill 0.51)
  Top 0.203: v46.48,15.98 46.1,16.36 46.1,17.07 45.7,17.47 U$1.25
  Bottom 0.203: v46.48,15.98 45.06,15.98 44.32,15.24 44.32,9.4 44.32,6.48 46.99,3.81 JP3.5
N$44  (via drill 0.51)
  Top 0.203: v45.47,26.04 45.21,26.04 44.7,25.52 44.7,25.27 U$1.30 | v33.02,16.51 33.66,16.51 34.67,15.49 35.69,14.48 35.69,13.59 35.69,12.83 33.91,11.05 33.78,10.92 v33.02,10.16 | U$1.30 44.7,24.26 U$1.30 | U$1.30
  Bottom 0.203: v45.47,26.04 45.21,25.78 36.07,25.78 35.05,24.77 33.02,22.73 v33.02,16.51 | v33.02,10.16 33.02,6.35 34.29,5.08 35.05,4.32 35.56,4.32 41.4,4.32 42.67,4.32 JP3.6
N$45  (via drill 0.51)
  Top 0.203: v44.32,22.22 44.32,22.35 43.81,22.86 43.2,23.47 43.18,23.5 43.2,23.52 U$1.36 | v36.83,5.97 35.81,4.95 34.16,4.95 29.08,4.95 26.54,4.95 JP4.1
  Bottom 0.203: v44.32,22.22 44.32,20.95 43.94,20.57 43.94,19.81 43.31,19.18 43.31,13.84 43.31,13.46 42.67,12.83 42.42,12.57 42.42,12.06 42.42,11.18 41.53,10.29 38.73,10.29 38.1,9.65 36.83,8.38 v36.83,5.97
N$46  (via drill 0.51)
  Top 0.203: v45.59,27.3 45.47,27.3 45.34,27.3 45.09,27.05 44.58,26.54 44.2,26.17 44.2,25.66 44.2,24.39 44.2,24.38 U$1.32 | v29.34,19.81 29.34,18.8 30.48,17.65 33.27,14.86 v33.27,11.68
  Bottom 0.203: v29.34,19.81 35.81,26.29 43.56,26.29 43.69,26.42 43.81,26.54 44.58,27.3 v45.59,27.3 | v33.27,11.68 32.89,11.68 31.62,10.41 25.4,4.19 23.24,4.19 JP4.2
N$47  (via drill 0.51)
  Top 0.203: v44.2,16.49 v44.2,16.48 v44.2,16.49 | v35.43,5.97 35.05,5.97 34.54,5.46 24.51,5.46 21.97,5.46 JP4.3 | v44.2,16.49 U$1.31
  Bottom 0.203: v44.2,16.48 44.2,16.36 44.2,16.23 43.81,15.85 43.81,14.73 43.81,13.46 43.81,13.33 43.18,12.7 42.93,12.45 42.93,11.94 42.93,11.05 42.29,10.41 41.66,9.78 41.02,9.78 38.99,9.78 37.72,8.51 37.72,5.46 37.21,4.95 36.2,4.95 35.43,5.71 v35.43,5.97
N$48  (via drill 0.51)
  Top 0.203: v42.93,22.35 42.29,22.99 | 42.29,22.99 42.2,23.08 | v34.16,6.48 33.66,5.97 33.02,5.97 21.34,5.97 19.3,3.94 19.18,3.81 17.78,3.81 JP4.4 | 42.2,23.08 U$1.40 | 42.29,22.99 42.2,23.08
  Bottom 0.203: v42.93,22.35 42.93,21.08 43.18,20.83 43.43,20.57 43.43,19.94 43.31,19.81 42.8,19.3 42.8,17.53 42.8,17.14 42.8,13.59 41.91,12.7 41.91,11.56 41.91,11.3 41.4,10.79 38.48,10.79 v34.16,6.48
N$49  (via drill 0.51)
  Top 0.203: 42.24,20.14 v42.42,20.32 42.24,20.14 | 42.2,20.1 42.24,20.14 | U$1.39 42.2,20.1 | 42.2,20.1 42.24,20.14
  Bottom 0.203: JP8.1 82.55,46.99 82.55,46.61 82.55,45.21 64.01,26.67 62.36,25.02 61.59,25.02 60.58,25.02 59.69,24.13 46.35,24.13 46.23,24.13 44.07,24.13 42.8,24.13 42.42,23.75 41.91,23.24 41.91,22.1 41.91,21.08 42.42,20.57 | 42.42,20.57 v42.42,20.32 42.42,20.57
N$50  (via drill 0.51)
  Top 0.203: 38.18,20.88 v37.97,21.08 38.18,20.88 | 38.2,20.86 38.18,20.88 | U$1.55 38.2,20.86 | 38.2,20.86 38.18,20.88
  Bottom 0.203: JP8.2 80.01,49.53 66.04,35.56 63.63,35.56 59.69,31.62 59.69,30.86 59.69,25.27 59.05,24.64 58.93,24.64 51.43,24.64 42.55,24.64 38.73,24.64 38.23,24.13 38.23,21.34 v37.97,21.08
N$51  (via drill 0.51)
  Top 0.203: v58.55,25.53 54.86,21.84 53.85,20.83 53.72,20.7 53.39,20.37 43.74,20.37 43.61,20.37 43.2,19.96 | 43.2,19.96 | 43.2,19.96 43.2,19.94 43.2,19.93 U$1.35
  Bottom 0.203: JP8.3 77.47,48.26 65.28,36.07 63.12,36.07 62.99,36.07 61.47,34.54 58.93,32 58.93,27.05 58.93,25.91 v58.55,25.53
N$52  (via drill 0.51)
  Top 0.203: U$1.38 42.68,24.27 42.67,24.26 42.7,24.29 42.7,26.19 42.7,26.7 42.8,26.8 45.47,29.46 45.97,29.46 46.1,29.46 55.63,29.46 57.4,29.46 v58.04,30.1
  Bottom 0.203: JP8.4 74.93,46.99 73.66,45.72 64.52,36.58 63.5,36.58 62.74,36.58 61.59,35.43 58.42,32.26 58.04,31.88 v58.04,30.1
N$53
  Top 0.203: U$1.54 38.68,24.26 U$1.54 38.7,26.63 38.7,29.81 39.24,30.35 39.37,30.48 40.89,32 42.8,32 47.5,32 63.63,48.13 63.63,48.9 63.63,52.2 JP8.5
N$54  (via drill 0.51)
  Top 0.203: v56.77,25.53 56.77,24.51 55.63,23.37 54.61,22.35 54.48,22.22 53.59,21.34 53.09,20.83 52.83,20.83 43.69,20.83 43.31,21.21 43.18,21.34 42.16,21.34 41.4,20.57 41.4,20.45 41.4,20.07 41.68,19.79 | 41.7,19.77 41.68,19.79 | U$1.41 41.7,19.77 | 41.7,19.77 41.68,19.79
  Bottom 0.203: JP8.6 69.85,44.45 60.96,35.56 56.77,31.37 v56.77,25.53
N$55  (via drill 0.51)
  Top 0.203: v34.29,20.45 34.29,19.05 36.83,16.51 38.1,16.51 42.04,16.51 42.67,17.14 | 42.67,17.14 42.7,17.17 | 42.7,17.17 U$1.37 | 42.67,17.14 42.7,17.17
  Bottom 0.203: JP8.7 67.31,43.18 60.96,36.83 56.01,31.88 55.75,31.62 55.75,27.56 55.75,25.65 55.63,25.53 55.24,25.15 53.09,25.15 45.59,25.15 36.45,25.15 34.29,22.99 v34.29,20.45
N$58
  Top 0.203: JP8.10 59.69,53.09 33.53,26.92 33.53,26.8 33.53,26.16 33.66,26.04 33.78,25.91 36.7,22.99 36.83,22.99 38.48,22.99 38.73,22.99 39.88,21.84 39.88,21.08 40.7,20.26 40.7,20.25 40.69,20.24 40.7,20.23 U$1.45
N$60  (via drill 0.51)
  Top 0.203: v54.61,45.72 53.34,45.72 39.37,31.75 38.2,30.58 38.2,26.77 38.2,24.28 38.23,24.26 38.21,24.27 U$1.56
  Bottom 0.203: v54.61,45.72 JP8.12
N$61
  Top 0.203: JP8.13 52.07,46.36 33.53,27.81 33.02,27.3 33.02,27.05 33.02,26.04 36.58,22.48 37.85,22.48 38.61,22.48 38.73,22.35 39.37,21.72 39.37,21.34 39.37,20.83 39.7,20.5 | 39.7,20.5 | U$1.49 39.7,20.5 | 39.7,20.5
N$62  (via drill 0.51)
  Top 0.203: 37.69,19.96 37.34,20.32 33.15,24.51 v32.38,24.51 | 37.7,19.96 37.69,19.96 | JP8.14 49.53,44.58 33.53,28.57 32.13,27.18 v32,27.05 | 37.7,19.96 37.69,19.96 | U$1.57 37.7,19.96 | 37.7,19.96 37.69,19.96
  Bottom 0.203: v32.38,24.51 31.88,25.02 31.88,25.27 31.88,26.92 v32,27.05
P_ON  (via drill 0.51)
  Top 0.203: v37.2,17.41 v37.21,17.4 37.21,17.42 37.2,17.43 U$1.59 | v37.21,14.1 38.61,12.7 44.45,12.7 v45.72,11.43 | v68.58,5.08 67.82,5.84 67.82,9.53 67.25,10.1 | S3.1 S3.2 66.55,10.79 67.25,10.1 | JP5.4 74.93,7.62 73.66,8.89 68.45,8.89 67.25,10.1
  Bottom 0.203: v37.21,14.1 v37.21,17.4 | v68.58,5.08 67.82,5.84 52.2,5.84 50.42,7.62 50.42,11.56 49.78,12.19 46.48,12.19 v45.72,11.43
RESET
  Top 0.203: U$1.34 43.7,27.06 45.59,28.96 54.99,28.96 56.9,27.05 59.18,27.05 60.71,25.53 62.48,25.53 70.61,17.4 70.61,14.35 71.5,13.46 75.31,13.46 77.22,11.56 77.22,8 76.45,7.24 76.45,3.56 JP5.3 | U$1.34 | U$1.34 43.69,24.26
RTC_BATT  (via drill 0.51)
  Top 0.203: 40.13,23.11 40,22.99 40,22.35 40.39,21.97 v40.89,21.46 | 40.13,23.11 40.2,23.18 | v40.89,11.68 41.53,11.05 41.78,11.05 44.83,11.05 45.34,10.54 v45.72,10.16 | 40.2,23.18 U$1.48 | 40.13,23.11 40.2,23.18
  Bottom 0.203: v40.89,21.46 40.89,19.43 41.66,18.67 41.78,18.54 42.29,18.03 42.29,14.35 42.29,13.97 41.66,13.33 40.89,12.57 v40.89,11.68 | JP5.7 67.31,3.81 65.79,5.33 52.96,5.33 51.94,5.33 50.42,6.86 49.91,7.37 49.91,9.78 49.91,11.43 49.66,11.68 47.24,11.68 v45.72,10.16
RXD0  (via drill 0.51)
  Top 0.203: v49.53,21.72 48.64,22.61 48.39,22.61 48.01,22.61 47.37,23.24 47.2,23.41 47.2,24.09 47.24,24.13 47.2,24.17 U$1.20 | v48.26,6.35 47.37,5.46 46.48,5.46 46.1,5.84 38.99,5.84 38.61,5.84 37.34,4.57 36.7,3.94 34.67,3.94 33.15,3.94 JP6.2 | 54.61,18.29 54.61,16 54.1,15.49 53.47,15.49 53.09,15.49 50.67,15.49 49.66,14.48 49.66,12.06 48.51,10.92 48.51,10.41 v48.51,10.29 | 54.61,18.29 v53.85,19.05 | SJ3.2 55.88,17.4 55.63,17.65 55.5,17.78 54.99,18.29 54.61,18.29
  Bottom 0.203: v48.26,6.35 48.51,6.6 v48.51,10.29 | v53.85,19.05 53.59,19.05 52.2,19.05 v49.53,21.72
RXD1  (via drill 0.51)
  Top 0.203: 41.22,17.45 v41.27,17.4 41.22,17.45 | 41.22,17.45 41.2,17.47 | 41.2,17.47 U$1.43 | 41.22,17.45 41.2,17.47
  Bottom 0.203: v41.27,17.4 41.27,13.72 40.89,13.33 40.13,12.57 39.88,12.57 32.89,12.57 30.48,10.16 25.4,5.08 24.13,5.08 11.43,5.08 5.08,5.08 3.81,3.81 JP7.2
RXLED  (via drill 0.51)
  Top 0.203: LED4.C 16.51,4.57 16.89,4.19 18.54,4.19 19.43,5.08 19.43,6.6 19.43,8.51 18.92,9.02 v18.8,9.14 | U3.22 25.02,15.14 v25.02,18.03
  Bottom 0.203: v18.8,9.14 18.8,9.27 19.3,9.78 22.61,9.78 25.02,12.19 v25.02,18.03
SIM_CLK
  Top 0.203: 45.24,17.35 45.47,17.12 45.59,16.99 45.59,16.87 45.59,15.85 45.59,15.75 45.47,15.62 44.83,14.99 44.32,14.99 43.56,14.99 43.43,15.11 43.05,15.49 36.58,15.49 36.2,15.49 35.81,15.88 35.69,16 34.8,16.89 26.67,25.02 26.61,25.08 26.42,25.27 16.21,35.48 U4.3 | 45.24,17.35 45.2,17.39 | 45.2,17.39 U$1.27 | 45.24,17.35 45.2,17.39
SIM_IO  (via drill 0.51)
  Top 0.203: v29.21,24.13 29.21,23.24 36.07,16.38 36.45,16 43.31,16 43.43,15.88 43.81,15.49 44.58,15.49 45.09,16 45.09,16.23 45.09,16.87 44.96,16.99 44.7,17.25 44.7,17.63 44.7,18.64 | 44.7,18.67 | 44.7,18.64 44.7,18.67 | 44.7,18.64 44.7,18.67 | U$1.29 44.7,18.65 44.7,18.64 | U4.4 18.83,25.87 v19.69,25.02
  Bottom 0.203: v29.21,24.13 28.32,25.02 25.91,25.02 v19.69,25.02
SIM_RST
  Top 0.203: 46.74,17.78 47.62,16.89 48.13,16.89 48.64,16.38 48.64,15.49 48.01,14.86 47.62,14.86 45.34,14.86 44.96,14.48 43.81,14.48 43.31,14.48 42.8,14.99 35.94,14.99 35.69,15.24 35.43,15.49 34.29,16.64 28.07,22.86 27.81,23.11 13.76,37.17 U4.2 | 46.74,17.78 46.7,17.82 | 46.7,17.82 U$1.21 | 46.74,17.78 46.7,17.82
SIM_VCC
  Top 0.203: 39.19,20.24 38.99,20.45 38.86,20.57 38.86,21.08 38.86,21.59 38.48,21.97 36.45,21.97 35.43,22.99 32.77,25.65 30.61,25.65 29.59,26.67 29.59,33.15 29.59,33.4 29.59,42.16 27.69,44.07 17.65,54.1 17.27,54.1 14.14,54.1 U4.1 | 39.2,20.24 39.19,20.24 | 39.2,20.24 39.19,20.24 | U$1.51 39.2,20.24 | 39.2,20.24 39.19,20.24
TXD0  (via drill 0.51)
  Top 0.203: v46.99,6.35 38.48,6.35 36.58,4.45 32.13,4.45 31.12,4.45 JP6.1 | v47.24,10.29 49.15,12.19 49.15,14.86 | v53.72,16.51 53.47,16.51 50.8,16.51 49.15,14.86 | 49.15,14.86 49.15,16.51 49.02,16.64 48.26,17.4 48.01,17.4 47.88,17.4 47.85,17.4 47.75,17.4 47.2,17.95 U$1.19 | v63.5,18.03 SJ2.2
  Bottom 0.203: v46.99,6.35 47.24,6.6 v47.24,10.29 | v63.5,18.03 54.48,18.03 53.72,17.27 v53.72,16.51
TXD1  (via drill 0.51)
  Top 0.203: 40.77,22.99 v41.02,22.73 40.77,22.99 | 40.77,22.99 40.7,23.05 | 40.7,23.05 U$1.46 | 40.77,22.99 40.7,23.05
  Bottom 0.203: v41.02,22.73 39.62,22.73 39.12,22.22 39.12,20.57 39.12,19.81 38.23,18.92 37.72,18.92 35.69,18.92 33.91,17.14 33.91,14.35 31.12,11.56 25.15,5.59 24.89,5.59 23.62,5.59 23.37,5.59 9.4,5.59 3.05,5.59 1.27,3.81 JP7.1
TXLED
  Top 0.203: LED3.C 17.78,16.51 19.05,17.78 23.24,17.78 24.38,16.64 24.42,16.6 U3.23
VCC  (via drill 0.51)
  Top 0.203: JP5.9 62.23,3.3 61.38,4.15 R5.2 | v66.67,8.89 66.67,6.22 65.28,4.83 64.9,4.83 62.61,2.54 JP5.9 | R1.2 63.46,44.07 | C5.A 67.31,53.34 66.46,52.49 C3.1 64.77,50.8 64.26,50.29 64.26,48.01 63.5,47.24 R1.2 | 52.7,17.91 52.68,17.91 | JP5.9 60.96,1.27 38.1,1.27 JP6.4 35.56,1.27 10.16,1.27 JP7.4 | 69.3,32.6 R3.2 | 69.3,32.6 68.58,31.88 v68.58,21.46 | U$1.7 50.66,18.91 50.67,18.92 50.69,18.91 U$1.5 50.79,18.91 50.8,18.92 50.81,18.91 U$1.3 51.3,18.91 51.31,18.92 51.32,18.91 U$1.1 52.7,17.91 | v52.83,17.91 52.7,17.91 | R1.2 63.59,43.94 64.01,43.94 65.2,42.75 U1.4 69.01,42.75 69.6,42.16 69.6,39.5 68.33,38.23 68.33,33.58 69.3,32.6
  Top 0.254: v68.58,21.46 69.98,21.46 71.12,20.32 LED1.A
  Bottom 0.203: v68.58,21.46 68.58,15.11 66.67,13.21 v66.67,8.89 60.58,14.99 53.59,14.99 52.58,16 52.58,17.65 v52.83,17.91
VCHG  (via drill 0.51)
  Top 0.203: v63.63,22.73 64.14,22.73 69.85,17.02 69.85,13.97 71.12,12.7 74.93,12.7 76.2,11.43 v76.2,8.89 | U$1.4 51.68,24.27 51.69,24.26 U$1.2 51.7,23.25 51.69,23.24 v52.07,22.86
  Bottom 0.203: v52.07,22.86 63.5,22.86 v63.63,22.73 | v76.2,8.89 80.01,5.08 JP5.2
VIN
  Top 0.203: U1.1 67.06,46.23 U1.2 69.8,46.15 70.48,45.47 70.48,39.62 71.63,38.48 80.64,38.48 81.79,37.34 81.79,30.48 80.52,29.21 76.2,29.21 74.97,27.98 S1.1
VOUT  (via drill 0.51)
  Top 0.203: 40.18,17.58 v40,17.4 40.18,17.58 | 40.18,17.58 40.2,17.59 | v45.72,13.97 40.13,13.97 v40,14.1 | 40.2,17.59 U$1.47 | 40.18,17.58 40.2,17.59
  Bottom 0.203: v40,14.1 v40,17.4 | v45.72,13.97 50.16,13.97 51.43,12.7 51.43,8.13 52.58,6.98 68.58,6.98 72.39,3.17 JP5.5

### Text on the board
Bottom: 1-6-2010
tPlace: SM5100B Eval Board | Use AT+SBAND=7 for North America | Use AT+SBAND=4 for Europe | NORMAL | Boot Mode | DOWNLOAD | ON | OFF | Power | Tx | 5V | Input | Rx | DTR | RTS | Tx | CTS | POWER_ON | Rx
bPlace: AUX_SPKN | AUX_MICN | AUX_SPKP | AUX_MICP | GND | GND | EAR_SPKP | EAR_SPKN | EAR_MICP | EAR_MICN | ADIN_2 | ADIN_1 | GPIO_46 | GPIO_26 | GPIO_20 | GPIO_19 | GPIO_18 | GPIO_17 | GPIO_16 | GPIO_10 | GPIO_9 | GPIO_8 | GPIO_6 | GPIO_4 | GPIO_3 | GPIO_1 | TXD1 | RXD1 | GND | VBAT | GND | KEY_SEN3 | KEY_SEN2 | KEY_SEN1 | KEY_SEN0 | TXD0 | RXD0 | GND | VBAT | GND | KEY_DRV5 | KEY_DRV4 | KEY_DRV3 | KEY_DRV2 | KEY_DRV1 | KEY_DRV0 | VBAT(3.8V) | GND | RTC_BATT | GPO_11 | VOUT | P_ON | RESET | VCHG | BOOT